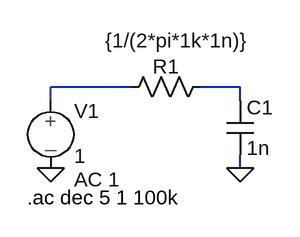
[diagram p0: schematic Draft2.asc]
Draft2.asc, the LTspice schematic file:
Version 4
SHEET 1 880 680
WIRE 128 112 32 112
WIRE 256 112 208 112
WIRE 32 128 32 112
WIRE 256 128 256 112
WIRE 256 208 256 192
FLAG 256 208 0
FLAG 32 208 0
SYMBOL source-V 32 112 R0
WINDOW 123 28 109 Left 2
WINDOW 39 0 0 Left 2
SYMATTR InstName V1
SYMATTR Value 1
SYMATTR Value2 AC 1
SYMBOL res 224 96 R90
WINDOW 0 7 56 VBottom 2
WINDOW 3 -55 45 VTop 2
SYMATTR InstName R1
SYMATTR Value {1/(2*pi*1k*1n)}
SYMBOL cap 240 128 R0
SYMATTR InstName C1
SYMATTR Value 1n
TEXT 4 242 Left 2 !.ac dec 5 1 100k

The netlist it stands for:
* Draft2.asc
V1 N001 0 1 AC 1
R1 N002 N001 {1/(2*pi*1k*1n)}
C1 N002 0 1n
.ac dec 5 1 100k
.backanno
.end